# EAGLE design magnetophone (EAGLE 7.2.0)
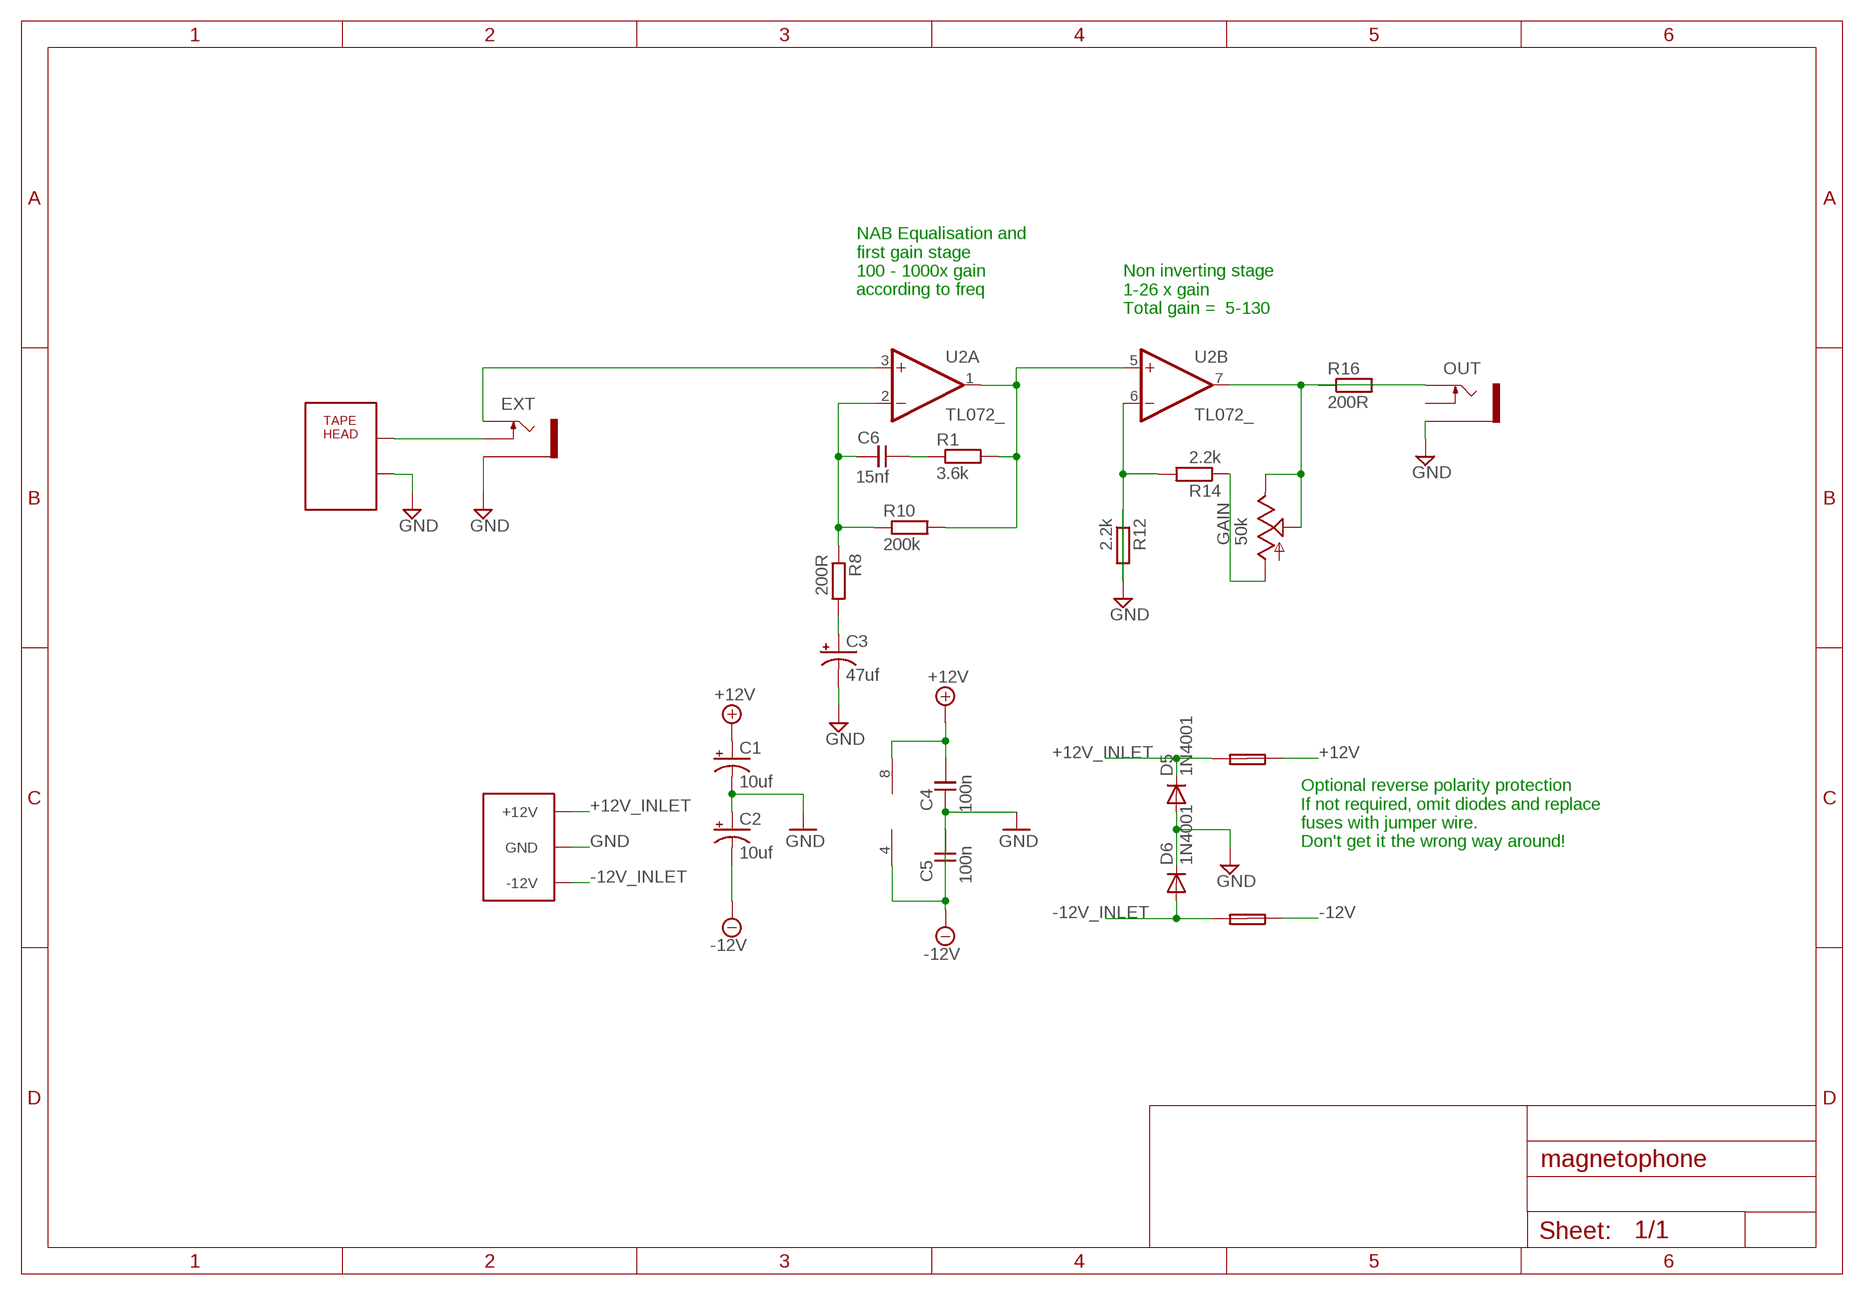
[diagram p0: schematic, sheet 1]

## Parts
1  FUSE  PTC_FUSEPOLY_FUSE  [C050H075X075]
C1  10uf  CAP_POLPTH2  [CPOL-RADIAL-10UF-25V]
C2  10uf  CAP_POLPTH2  [CPOL-RADIAL-10UF-25V]
C3  47uf  CAP_POLPTH2  [CPOL-RADIAL-10UF-25V]
C4  100n  C-EU050-024X044  [C050-024X044]
C5  100n  C-EU050-024X044  [C050-024X044]
C6  15nf  C-EU050-024X044  [C050-024X044]
D5  1N4001  1N4004  [DO41-10]
D6  1N4001  1N4004  [DO41-10]
EXT  THONKICONNNEW  [WQP-PJ301M-12_JACK]
FUSE  FUSE  PTC_FUSEPOLY_FUSE  [C050H075X075]
GAIN  50k  ALPHA-9MMF2A  [EVUF]
OUT  THONKICONNNEW  [WQP-PJ301M-12_JACK]
R1  3.6k  RESISTOR7MM  [7MM_RESISTOR]
R8  200R  RESISTOR7MM  [7MM_RESISTOR]
R10  200k  RESISTOR7MM  [7MM_RESISTOR]
R12  2.2k  RESISTOR7MM  [7MM_RESISTOR]
R14  2.2k  RESISTOR7MM  [7MM_RESISTOR]
R16  200R  RESISTOR7MM  [7MM_RESISTOR]
U2  TL072_  [DIL08]
U$1  MONO_CASSETTE_HEAD  [MONO_CASSETTE_HEAD]
U$2  EURO_POWER_LOCK  [EURO_PWR_HEADER_LOCK]

## Nets
+12V [power]: 1.2 C1.1(+) C4.1 U2.8(P:V+)
+12V_INLET: 1.1 D5.C U$2.POS1(+12V) U$2.POS2(+12V)
-12V [power]: C2.2(-) C5.1 FUSE.2 U2.4(P:V-)
-12V_INLET: D6.A FUSE.1 U$2.NEG1(-12V) U$2.NEG2(-12V)
GND [ground]: C1.2(-) C2.1(+) C3.2(-) C4.2 C5.2 D5.A D6.C EXT.P$3_SLEEVE(SLEEVE) OUT.P$3_SLEEVE(SLEEVE) R12.1 U$1.P$2 U$2.GND1(GND) U$2.GND2(GND) U$2.GND3(GND) U$2.GND4(GND) U$2.GND5(GND) U$2.GND6(GND)
N$1: EXT.P$2_SWITCH(SWITCH) U$1.P$1
N$2: EXT.P$1_TIP(TIP) U2.3(A:+IN)
N$3: C6.2 R8.1 R10.1 U2.2(A:-IN)
N$4: R1.2 R10.2 U2.1(A:OUT) U2.5(B:+IN)
N$5: GAIN.1(A) R14.1
N$6: R12.2 R14.2 U2.6(B:-IN)
N$7: C3.1(+) R8.2
N$8: GAIN.2(S) GAIN.3(E) R16.2 U2.7(B:OUT)
N$9: C6.1 R1.1
N$10: OUT.P$1_TIP(TIP) R16.1
Unconnected: OUT.P$2_SWITCH(SWITCH)

## Notes on the sheet
- NAB Equalisation and 
  first gain stage
  100 - 1000x gain 
  according to freq
- Non inverting stage
  1-26 x gain
  Total gain =  5-130
- Optional reverse polarity protection
  If not required, omit diodes and replace
  fuses with jumper wire. 
  Don't get it the wrong way around!

## Library data of the parts
1 FUSE = TomW:PTC_FUSE
C1-C3 = SparkFun-Passives:CAP_POL: Capacitor Polarized These are standard SMD and PTH capacitors. Normally 10uF, 47uF, and 100uF in electrolytic and tantalum varieties. Always verify the external diameter of the through hole cap, it varies with capacity, voltage, and manufacturer. The EIA devices should be standard.
C4-C6 = TomW:C-EU: CAPACITOR, European symbol
D5 D6 = diode:1N4004: DIODE general purpose rectifier, 1 A
EXT OUT = MusicThingModular:THONKICONN: 3.5mm socket for Eurorack modular synths
GAIN = TomW:ALPHA-9MM: 9 mm Square Rotary Potentiometers Source: Panasonic
R1 R8 R10 R12 R14 R16 = MusicThingModular:RESISTOR: Standard resistor, various versions
U2 = MusicThingModular:TL072: Generic Dual Op Amp
U$1 = MusicThingModular:MONO_CASSETTE_HEAD
U$2 = MusicThingModular:EURO_POWER_LOCK

## Net classes
0 default: width 0.305 mm
1 power: width 0.61 mm
2 ground: width 0.61 mm

## Board
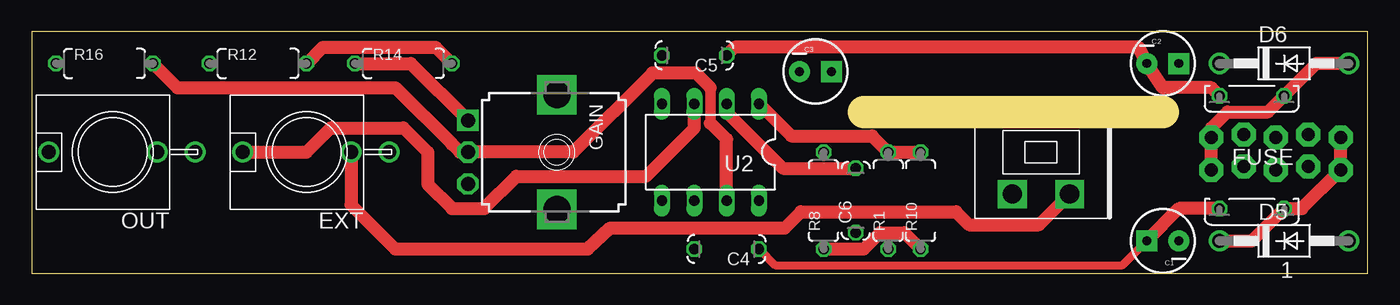
[diagram p1: board, top side]
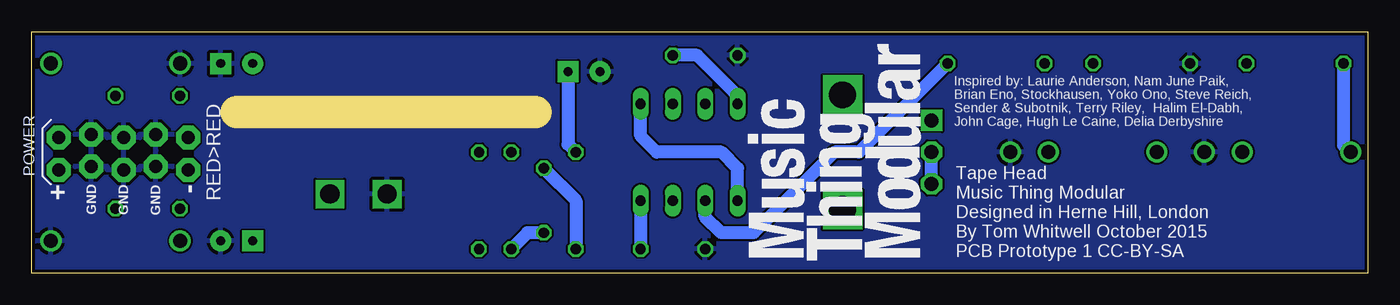
[diagram p2: board, bottom side, seen from below]

Size 105 x 19 mm. Coordinates in mm from the lower left corner, seen from the top.
Outline: 0,19 0,0 105,0 105,19 0,19
Copper layers (1*2*15*16): Top 0.035mm / dielectric 0.2mm / Route2 0.0175mm / dielectric 1.1mm / Route15 0.0175mm / dielectric 0.2mm / Bottom 0.035mm
Design rules "SeeedStudio_DRU_no_angle_20130527": minimum track width 6mil, minimum drill 12mil, track to track 6mil, track to pad 6mil, pad to pad 6mil, via to via 6mil, smd to smd 0mil, copper to edge 10mil, drill to drill 10mil, minimum pad ring 6mil, minimum via ring 6mil, stop-mask expansion 2mil, vias tented up to drill 25mil, thermal gap 10mil
Milling: 1 lines

### Footprints (pad centres in the part's own frame; a part is rotated, then mirrored left to right if it is on the bottom)
C050H075X075 = drill 0.813 octagon: 1 -2.54,0; 2 2.54,0
CPOL-RADIAL-10UF-25V = drill 0.7 pad 1.651 square: 1 1.27,0 | drill 0.7 pad 1.651: 2 -1.27,0
C050-024X044 = drill 0.813 octagon: 1 -2.54,0; 2 2.54,0
DO41-10 = drill 1.118: A 5.08,0; C -5.08,0
WQP-PJ301M-12_JACK = drill 1.1: P$1_TIP 0,5; P$2_SWITCH 0,-3.5; P$3_SLEEVE 0,-6.5
EVUF = drill 1.1 pad 1.676 square: 1 -2.5,-7 | drill 1.1 pad 1.676 octagon: 2 0,-7; 3 2.5,-7 | drill 2.1 pad 2.8 square: M1 4.5,0; M2 -4.5,0
7MM_RESISTOR = drill 0.813 octagon: 1 -3.81,0; 2 3.81,0
DIL08 = drill 0.813 pad 1.27 long: 1 -3.81,-3.81; 2 -1.27,-3.81; 3 1.27,-3.81; 4 3.81,-3.81; 5 3.81,3.81; 6 1.27,3.81; 7 -1.27,3.81; 8 -3.81,3.81
MONO_CASSETTE_HEAD = drill 1.5 square: P$1 -2.25,3.3; P$2 2.25,3.3
EURO_PWR_HEADER_LOCK = drill 1.016 pad 1.88 octagon: GND1 -2.54,1.143; GND2 -2.54,-1.397; GND3 0,1.397; GND4 0,-1.143; GND5 2.54,1.143; GND6 2.54,-1.397; NEG1 -5.08,1.397; NEG2 -5.08,-1.143; POS1 5.08,1.397; POS2 5.08,-1.143

### Placement (x,y rotation side)
1  95.89,5.08 180 top
C1  88.9,2.54 180 top
C2  88.9,16.51 0 top
C3  61.59,15.88 0 top
C4  54.61,1.91 180 top
C5  52.07,17.14 180 top
C6  64.77,5.71 90 top
D5  98.42,2.54 0 top
D6  98.42,16.51 0 top
EXT  21.59,9.53 90 top
FUSE  95.89,13.97 180 top
GAIN  41.27,9.53 270 top
OUT  6.35,9.53 90 top
R1  67.31,5.71 90 top
R8  62.23,5.71 90 top
R10  69.85,5.71 90 top
R12  17.78,16.51 0 top
R14  29.21,16.51 0 top
R16  5.71,16.51 0 top
U2  53.34,9.53 180 top
U$1  79.32,9.53 180 top
U$2  97.79,9.53 180 bottom

### Tracks (layer width: path | path; a pad name or v marks a point on that pad's centre or on a via)
+12V
  Top 0.61: C4.1 58.42,0.64 85.72,0.64 C1.1
  Top 1.016: 1.2 90.17,5.08 C1.1
  Bottom 1.016: U2.8 C4.1
+12V_INLET
  Top 1.016: D5.C 95.89,2.54 1.1 99.82,5.08 U$2.POS1 U$2.POS2
-12V
  Top 1.016: C5.1 55.24,17.78 87,17.78 C2.2 88.9,14.61 92.71,14.61 FUSE.2
  Bottom 1.016: U2.4 49.53,13.97 52.7,17.14 C5.1
-12V_INLET
  Top 1.016: D6.A 100.97,16.51 FUSE.1 97.16,12.7 93.98,12.7 92.71,11.43 U$2.NEG2 U$2.NEG1
GND
  pour Bottom: 0,21.91 -1.27,-1.27 106.16,-0.64 106.16,21.27
N$1
  Top 1.016: EXT.P$2_SWITCH 25.09,5.39 28.57,1.91 43.69,1.91 45.47,3.56 59.18,3.56 60.45,4.83 72.64,4.83 73.66,3.81 79.16,3.81 U$1.P$1
N$2
  Top 1.016: EXT.P$1_TIP 21.59,9.53 23.5,11.43 29.21,11.43 31.11,9.53 31.11,6.99 33.02,5.08 35.56,5.08 38.1,7.62 48.26,7.62 52.07,11.43 U2.3
N$3
  Top 1.016: U2.2 54.61,12.7 59.05,8.26 C6.2 | R8.1 65.41,1.91 66.67,3.17 68.58,3.17 R10.1
  Bottom 1.016: C6.2 62.23,5.71 R8.1
N$4
  Top 1.016: U2.1 59.69,10.79 66.04,10.79 R1.2 R10.2
  Bottom 1.016: U2.5 49.53,8.26 50.8,9.53 55.88,9.53 57.15,10.79 U2.1
N$5
  Top 1.016: R14.1 29.79,16.51 GAIN.1
N$6
  Top 1.016: R12.2 22.86,17.78 31.75,17.78 R14.2
  Bottom 1.016: R14.2 40.01,9.53 41.91,9.53 48.26,3.17 50.8,3.17 52.07,4.45 U2.6
N$7
  Bottom 1.016: C3.1 62.87,10.16 R8.2
N$8
  Top 0.813: 53.34,11.81 53.34,14.61
  Top 1.016: R16.2 11.43,14.61 28.56,14.61 33.02,10.16 33.66,9.53 GAIN.2 42.55,9.53 48.77,15.75 52.2,15.75 53.34,14.61 | U2.7 54.61,10.54 53.34,11.81
  Bottom 1.016: GAIN.3 GAIN.2
N$9
  Bottom 1.016: C6.1 66.04,3.17 R1.1
N$10
  Bottom 1.016: R16.1 1.91,10.08 OUT.P$1_TIP

### Text on the board
Dimension: Cut out
bPlace: Inspired by: Laurie Anderson, Nam June Paik, / Brian Eno, Stockhausen, Yoko Ono, Steve Reich, / Sender & Subotnik, Terry Riley, Halim El-Dabh, / John Cage, Hugh Le Caine, Delia Derbyshire | Tape Head / Music Thing Modular / Designed in Herne Hill, London / By Tom Whitwell October 2015 / PCB Prototype 1 CC-BY-SA